# Altium schematic sheet GPS.SchDoc
size A
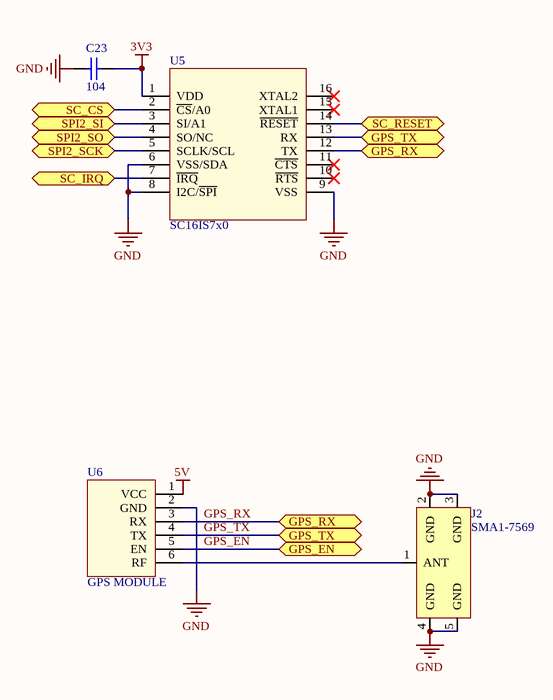
[diagram p0: GPS.SchDoc]

## Parts
C23  104  [C0603]
J2  SMA1-7569  [ANTENA STAND]
U5  SC16IS7x0  [SSOP16_M]
U6  GPS MODULE  [GPS DEMETER]

## Ports
GPS_EN, GPS_RX, GPS_TX, SC_CS, SC_IRQ, SC_RESET, SPI2_SCK, SPI2_SI, SPI2_SO

## Nets
3V3: C23.2 U5.1(VDD)
5V: U6.1(VCC)
GND: C23.1 J2.2(GND) J2.3(GND) J2.4(GND) J2.5(GND) U5.6(VSS/SDA) U5.8(I2C/~{SPI}) U5.9(VSS) U6.2(GND)
GPS_EN: U6.5(EN) ; port GPS_EN
GPS_RX: U5.12(TX) U6.3(RX) ; port GPS_RX
GPS_TX: U5.13(RX) U6.4(TX) ; port GPS_TX
SC_CS: U5.2(~{CS}/A0) ; port SC_CS
SC_IRQ: U5.7(~{IRQ}) ; port SC_IRQ
SC_RESET: U5.14(~{RESET}) ; port SC_RESET
SPI2_SCK: U5.5(SCLK/SCL) ; port SPI2_SCK
SPI2_SI: U5.3(SI/A1) ; port SPI2_SI
SPI2_SO: U5.4(SO/NC) ; port SPI2_SO
NetJ2_1: J2.1(ANT) U6.6(RF)

Not connected (* = marked no-connect by the designer): U5 10(~{RTS})* 11(~{CTS})* 15(XTAL1)* 16(XTAL2)*

## Library data of the parts
C23 = Cap_SMT: CAP CER 0.1UF 16V Y5V 0402; Manufacturer: Yageo; Manufacturer Part Number: CC0603ZRY5V7BB104; Published: 8-Jun-2000; LatestRevisionDate: 17-Jul-2002; LatestRevisionNote: Re-released for DXP Platform.; PackageReference: C0603; Publisher: Altium Limited; Digi-Key Part Number: 311-1047-1-ND; Unit Price: 0.00648; Value: 104
J2 = SMA-R/A-F: Unit Price: 0.5; Digi-Key Part Number: NA